# EAGLE design Frigo-Ctl2 (EAGLE 9.0.1)
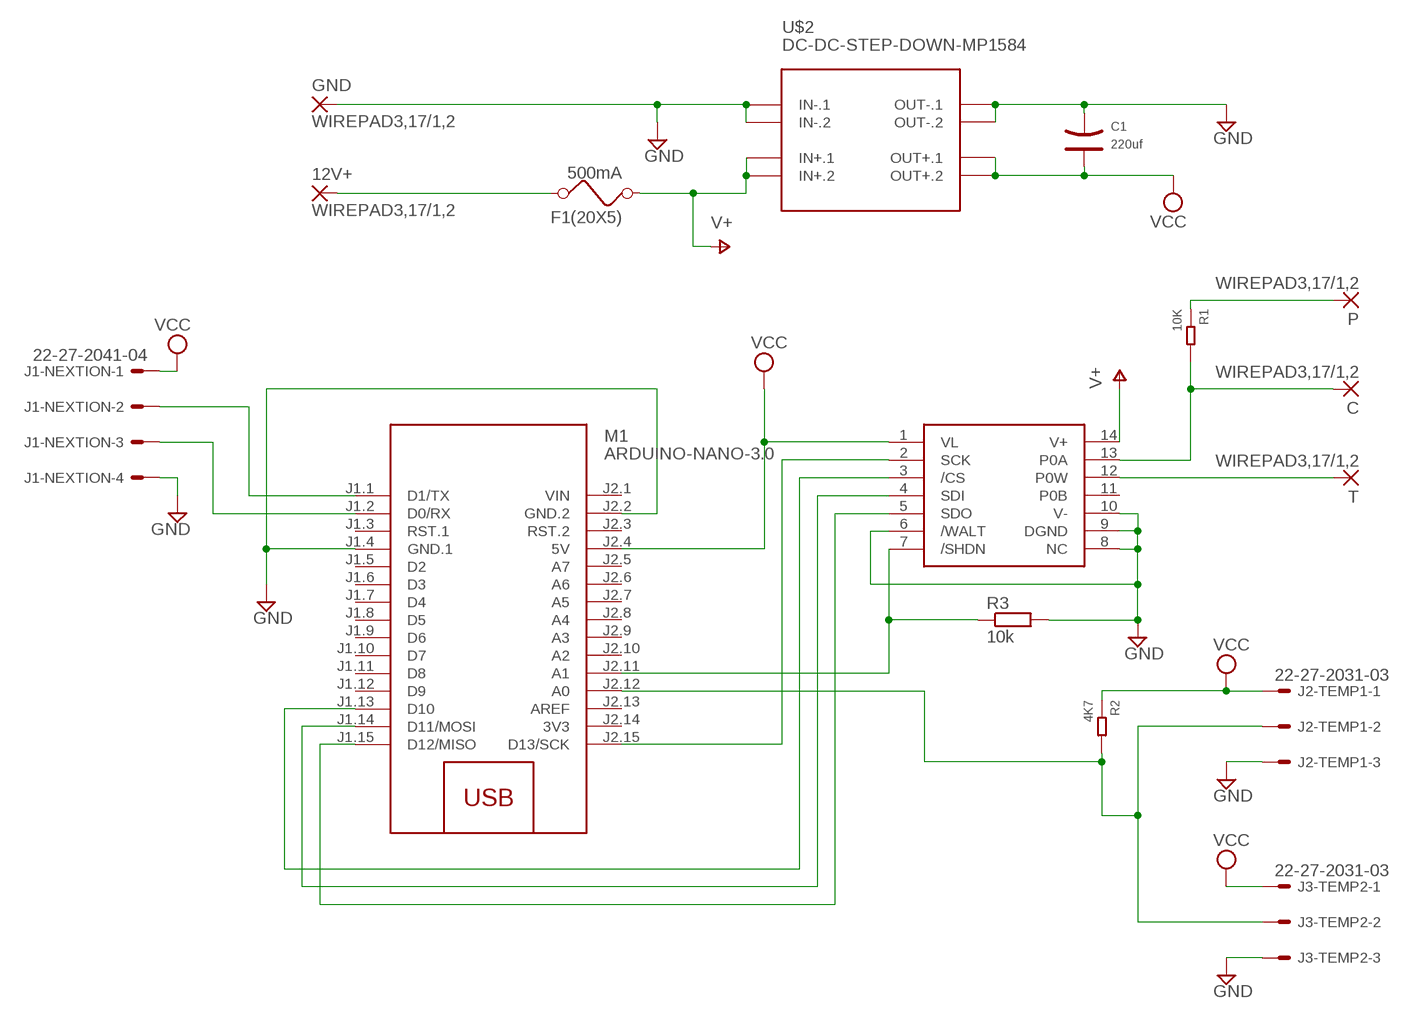
[diagram p0: schematic, sheet 1]

## Parts
12V+  WIREPAD3,17/1,2  [3,17/1,2]
C  WIREPAD3,17/1,2  [3,17/1,2]
C1  220uf  DIP-ALUMINUM-100UF-16V(D5-H7MM)  [PC-D5.3MM]
F1(20X5)  500mA  FUSE  [FUSE]
GND  WIREPAD3,17/1,2  [3,17/1,2]
J1-NEXTION  22-27-2041-04  [6410-04]
J2-TEMP1  22-27-2031-03  [6410-03]
J3-TEMP2  22-27-2031-03  [6410-03]
M1  ARDUINO-NANO-3.0  [ARDUINO-NANO-3.0]
P  WIREPAD3,17/1,2  [3,17/1,2]
R1  10K  DIP-RES-10K-5%-1/4W(PR-D2.3XL6.5MM)  [PR-D2.3XL6.5MM]
R2  4K7  DIP-RES-10K-5%-1/4W(PR-D2.3XL6.5MM)  [PR-D2.3XL6.5MM]
R3  10k  R-EU_R1206  [R1206]
T  WIREPAD3,17/1,2  [3,17/1,2]
U$1  MCP41HV51  [TSSOP14]
U$2  DC-DC-STEP-DOWN-MP1584  [DC-DC-STEP-DOWN-MP1584]

## Nets
GND: C1.- GND.1(P) J1-NEXTION.4 J2-TEMP1.3 J3-TEMP2.3 M1.J1.4(GND.1) M1.J2.2(GND.2) R3.2 U$1.6(/WALT) U$1.8(NC) U$1.9(DGND) U$1.10(V-) U$2.IN-.1 U$2.IN-.2 U$2.OUT-.1 U$2.OUT-.2
N$1: 12V+.1(P) F1(20X5).2
N$2: M1.J2.11(A1) R3.1 U$1.7(/SHDN)
N$3: J1-NEXTION.2 M1.J1.1(D1/TX)
N$4: J1-NEXTION.3 M1.J1.2(D0/RX)
N$5: C.1(P) R1.2 U$1.13(P0A)
N$6: P.1(P) R1.1
N$7: M1.J1.13(D10) U$1.3(/CS)
N$8: T.1(P) U$1.12(P0W)
N$9: M1.J2.15(D13/SCK) U$1.2(SCK)
N$10: M1.J1.15(D12/MISO) U$1.5(SDO)
N$11: M1.J1.14(D11/MOSI) U$1.4(SDI)
N$13: J2-TEMP1.2 J3-TEMP2.2 M1.J2.12(A0) R2.2
V+: F1(20X5).1 U$1.14(V+) U$2.IN+.1 U$2.IN+.2
VCC: C1.+ J1-NEXTION.1 J2-TEMP1.1 J3-TEMP2.1 M1.J2.4(5V) R2.1 U$1.1(VL) U$2.OUT+.1 U$2.OUT+.2
Unconnected: M1.J1.3(RST.1) M1.J1.5(D2) M1.J1.6(D3) M1.J1.7(D4) M1.J1.8(D5) M1.J1.9(D6) M1.J1.10(D7) M1.J1.11(D8) M1.J1.12(D9) M1.J2.3(RST.2) M1.J2.5(A7) M1.J2.6(A6) M1.J2.7(A5) M1.J2.8(A4) M1.J2.9(A3) M1.J2.10(A2) M1.J2.13(AREF) U$1.11(P0B)

## Power pins joined to a net without a drawn wire
3V3: M1.J2.14(3V3)
VIN: M1.J2.1(VIN)

## Library data of the parts
12V+ C GND P T = wirepad:WIREPAD: Wire PAD connect wire on PCB
C1 = Seeed-Capacitor:DIP-ALUMINUM-100UF-16V(D5-H7MM): 302030031; MPN: KS 100uF/16V; VALUE: 100uf
F1(20X5) = special:FUSE: FUSE 5 x 20 mm
J1-NEXTION = con-molex:22-?-04: CONNECTOR wire to board 2.54 mm (.1 inch) pitch header; MF: MOLEX; OC_FARNELL: unknown; OC_NEWARK: unknown
J2-TEMP1 J3-TEMP2 = con-molex:22-?-03: CONNECTOR wire to board 2.54 mm (.1 inch) pitch header; MF: MOLEX; OC_FARNELL: unknown; OC_NEWARK: unknown
M1 = diy-modules:ARDUINO-NANO-3.0: Arduino Nano 3.0 and compatible devices More details available here: https://www.arduino.cc/en/Main/ArduinoBoardNano Click here to find device on ebay.com <http://www.ebay.com/sch/arduino+nano>
R1 = Seeed-Resistor:DIP-RES-10K-5%-1/4W(PR-D2.3XL6.5MM): 301020001; MPN: FHCFR-1/4W-103J
R2 = Seeed-Resistor:DIP-RES-10K-5%-1/4W(PR-D2.3XL6.5MM): 301020001; MPN: FHCFR-1/4W-103J; VALUE: 10K
R3 = resistor:R-EU_: RESISTOR, European symbol
U$1 = MCP41HV51:MCP41HV51: 8-Bit Single, +36V (±18V) Digital POT with SPI Serial Interface and Volatile Memory
U$2 = diy-modules:DC-DC-STEP-DOWN-MP1584: DC/DC Step-Down Regulator based on MP1584 chip MP1584 datasheet available here: http://www.haoyuelectronics.com/Attachment/MP1584/MP1584.pdf Click here to find device on ebay.com <http://www.ebay.com/sch/mp1584+module>

## Board
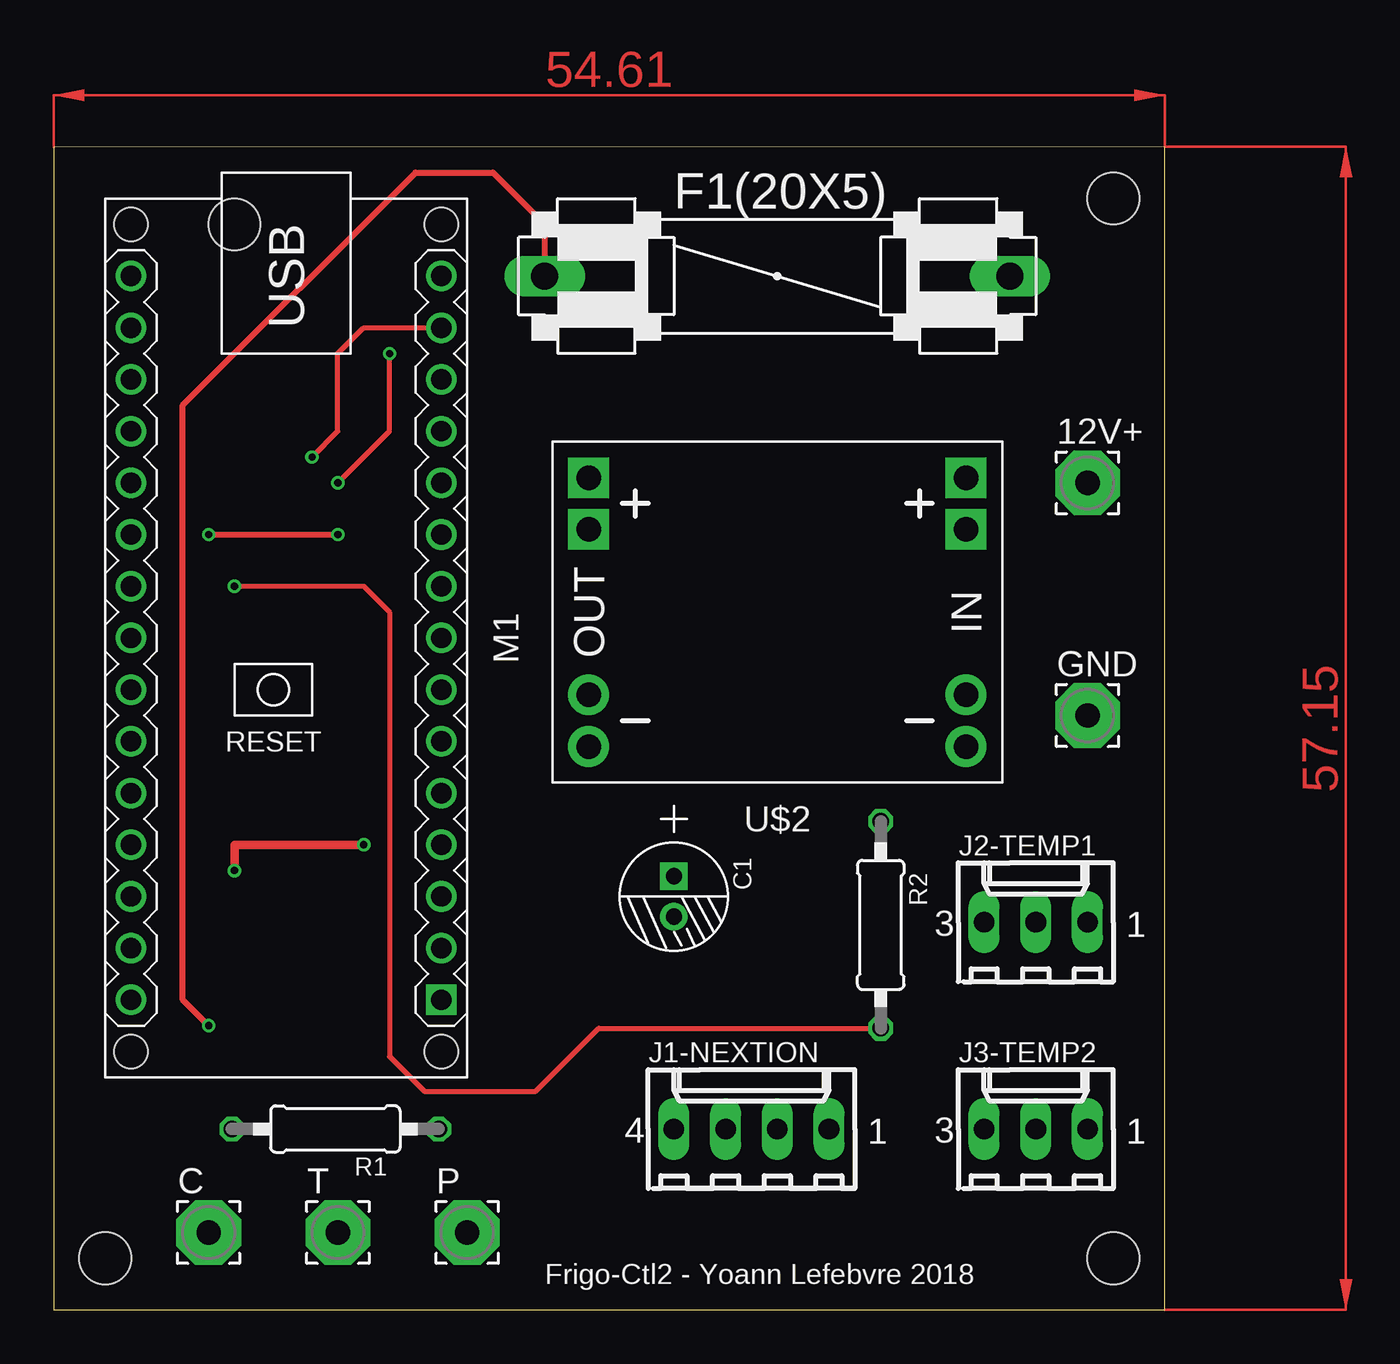
[diagram p1: board, top side]
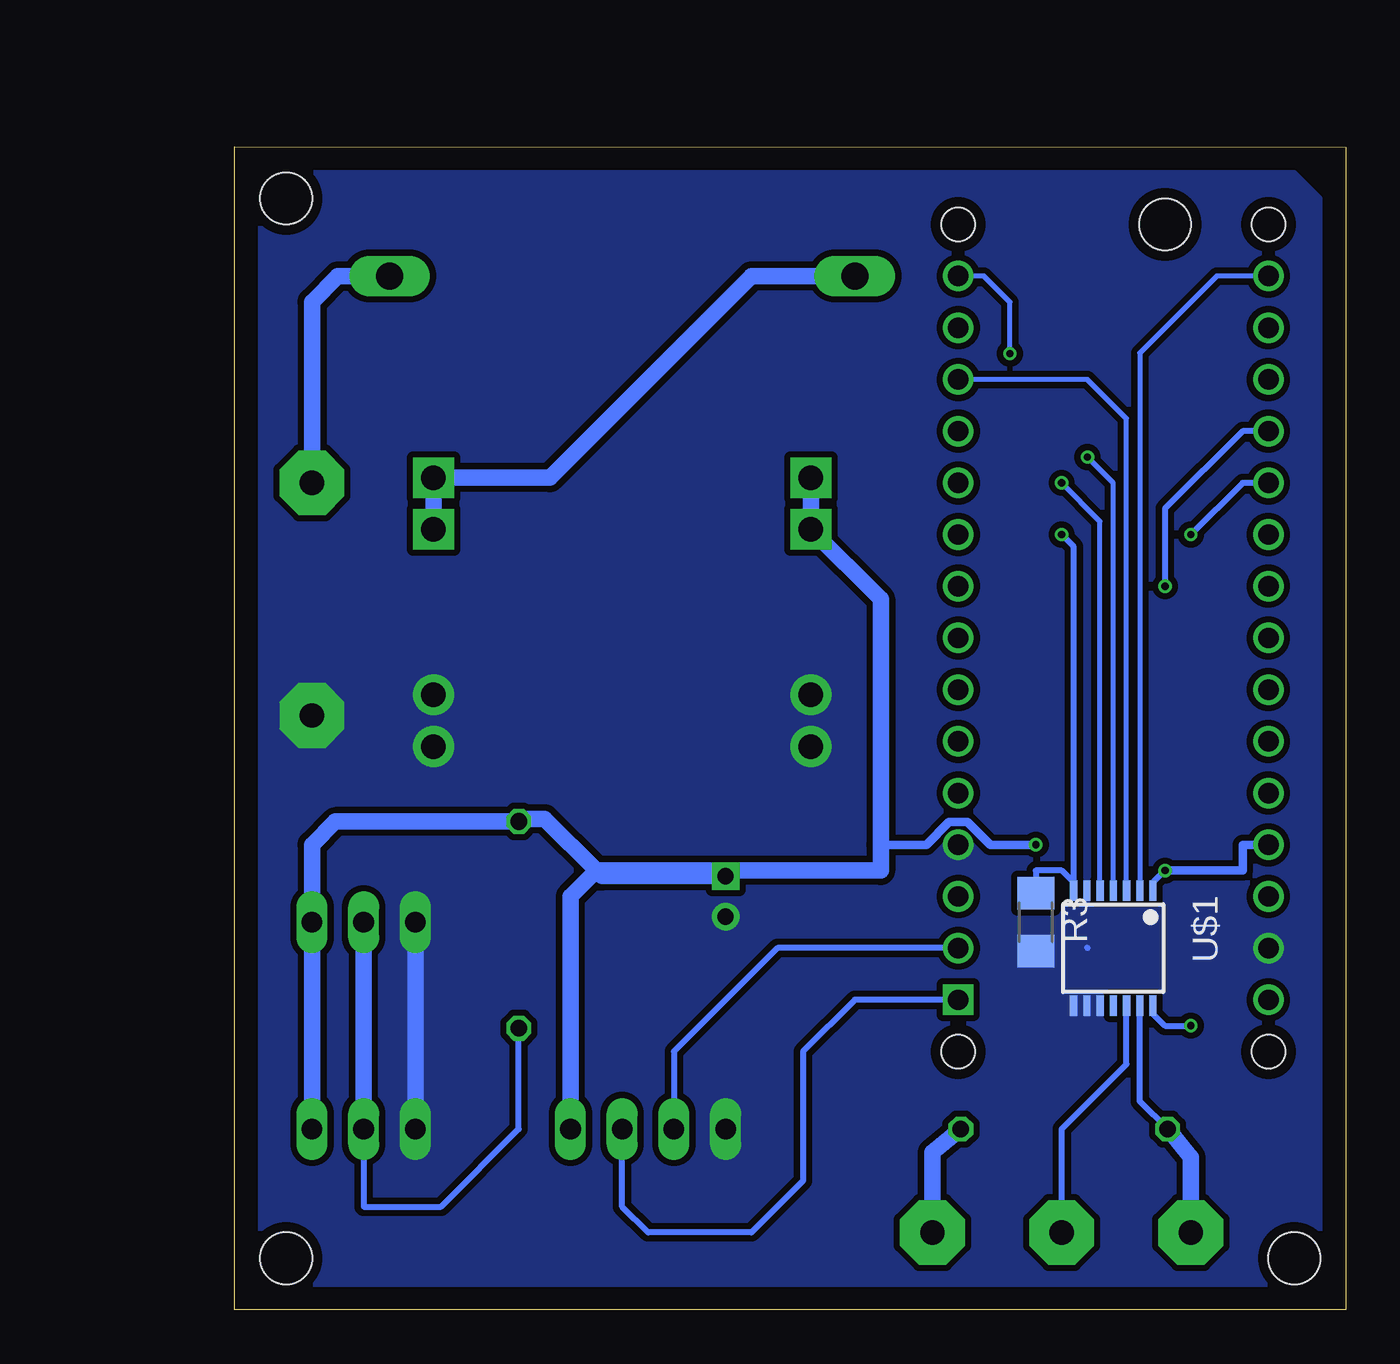
[diagram p2: board, bottom side, seen from below]

Size 54.61 x 57.15 mm. Coordinates in mm from the lower left corner, seen from the top.
Outline: 0,0 54.61,0 54.61,57.15 0,57.14 0,0
Copper layers (1*16): Top 0.035mm / dielectric 1.6mm / Bottom 0.035mm
Design rules "Elecrow_2-layer_PCB_eagle_rule": minimum track width 6mil, minimum drill 12mil, track to track 6mil, track to pad 6mil, pad to pad 6mil, via to via 8mil, smd to smd 0mil, copper to edge 20mil, drill to drill 10mil, minimum pad ring 6mil, minimum via ring 6mil, stop-mask expansion 0mil, vias tented up to drill 100mil, thermal gap 10mil
Holes 2.54 mm at 52.07,54.61 2.54,2.54 8.89,53.34 52.07,2.54

### Footprints (pad centres in the part's own frame; a part is rotated, then mirrored left to right if it is on the bottom)
3,17/1,2 = drill 1.194 pad 3.175 octagon: 1 0,0
PC-D5.3MM = drill 0.8 pad 1.35 square: + -1,0 | drill 0.8 pad 1.35: - 1,0
FUSE = drill 1.321 long: 1 -11.43,0; 2 11.43,0
6410-04 = drill 1.016 long: 1 3.81,0; 2 1.27,0; 3 -1.27,0; 4 -3.81,0
6410-03 = drill 1.016 long: 1 2.54,0; 2 0,0; 3 -2.54,0
ARDUINO-NANO-3.0 = drill 1 square: J1.1 17.78,7.62 | drill 1: J1.2 15.24,7.62; J1.3 12.7,7.62; J1.4 10.16,7.62; J1.5 7.62,7.62; J1.6 5.08,7.62; J1.7 2.54,7.62; J1.8 0,7.62; J1.9 -2.54,7.62; J1.10 -5.08,7.62; J1.11 -7.62,7.62; J1.12 -10.16,7.62; J1.13 -12.7,7.62; J1.14 -15.24,7.62; J1.15 -17.78,7.62; J2.1 17.78,-7.62; J2.2 15.24,-7.62; J2.3 12.7,-7.62; J2.4 10.16,-7.62; J2.5 7.62,-7.62; J2.6 5.08,-7.62; J2.7 2.54,-7.62; J2.8 0,-7.62; J2.9 -2.54,-7.62; J2.10 -5.08,-7.62; J2.11 -7.62,-7.62; J2.12 -10.16,-7.62; J2.13 -12.7,-7.62; J2.14 -15.24,-7.62; J2.15 -17.78,-7.62 | hole 1.651: -20.32,7.62; -20.32,-7.62; 20.32,-7.62; 20.32,7.62
PR-D2.3XL6.5MM = drill 0.813 octagon: 1 -4.953,0; 2 5.207,0
R1206 = smd 1.6 x 1.803: 1 -1.422,0; 2 1.422,0
TSSOP14 = smd 0.35 x 1: 1 -1.95,-2.825; 2 -1.3,-2.825; 3 -0.65,-2.825; 4 0,-2.825; 5 0.65,-2.825; 6 1.3,-2.825; 7 1.95,-2.825; 8 1.95,2.825; 9 1.3,2.825; 10 0.65,2.825; 11 0,2.825; 12 -0.65,2.825; 13 -1.3,2.825; 14 -1.95,2.825
DC-DC-STEP-DOWN-MP1584 = drill 1.2 pad 2 square: IN+.1 -9.271,-4.064; IN+.2 -9.271,-6.604; OUT+.1 9.271,-4.064; OUT+.2 9.271,-6.604 | drill 1.2 pad 2: IN-.1 -9.271,6.604; IN-.2 -9.271,4.064; OUT-.1 9.271,6.604; OUT-.2 9.271,4.064

### Placement (x,y rotation side)
12V+  50.8,40.64 0 top
C  7.62,3.81 0 top
C1  30.48,20.32 270 top
F1(20X5)  35.56,50.8 0 top
GND  50.8,29.21 0 top
J1-NEXTION  34.29,8.89 0 top
J2-TEMP1  48.26,19.05 0 top
J3-TEMP2  48.26,8.89 0 top
M1  11.43,33.02 270 top
P  20.32,3.81 0 top
R1  13.97,8.89 180 top
R2  40.64,19.05 270 top
R3  15.24,19.05 270 bottom
T  13.97,3.81 0 top
U$1  11.43,17.78 180 bottom
U$2  35.56,34.29 180 top

### Tracks (layer width: path | path; a pad name or v marks a point on that pad's centre or on a via)
GND
  Bottom 0.305: 12.73,17.81 12.7,17.78
  Bottom 0.813: J3-TEMP2.3 J2-TEMP1.3
  pour Bottom (isolate 0.305, no thermals): 2.54,55.88 52.07,55.88 53.34,54.61 53.34,2.54 52.07,1.27 2.54,1.27 1.27,2.54 1.27,54.61
N$1
  Bottom 0.813: F1(20X5).2 49.53,50.8 50.8,49.53 12V+.1
N$2  (via drill 0.35)
  Top 0.305: v7.62,38.1 v13.97,38.1
  Bottom 0.305: R3.1 15.24,21.59 13.97,21.59 13.38,21 U$1.7 13.38,37.51 v13.97,38.1 | M1.J2.11 5.08,40.64 v7.62,38.1
N$3
  Bottom 0.305: J1-NEXTION.2 35.29,8.89 35.56,8.62 35.56,5.08 34.29,3.81 29.21,3.81 26.67,6.35 26.67,12.7 24.13,15.24 M1.J1.1
N$4
  Bottom 0.305: M1.J1.2 27.94,17.78 33.02,12.7 J1-NEXTION.3
N$5
  Bottom 0.305: R1.2 10.13,10.26 U$1.13
  Bottom 0.813: R1.2 7.62,7.49 C.1
N$6
  Bottom 0.813: P.1 20.32,7.75 R1.1
N$7
  Bottom 0.254: U$1.3 10.78,43.8 12.7,45.72 M1.J1.13
N$8
  Bottom 0.305: U$1.12 10.78,12.08 13.97,8.89 T.1
N$9
  Bottom 0.254: M1.J2.15 6.35,50.8 10.13,47.02 U$1.2
N$10  (via drill 0.35)
  Top 0.254: v13.97,40.64 16.51,43.18 v16.51,46.99
  Bottom 0.254: U$1.5 12.08,38.75 v13.97,40.64 | v16.51,46.99 16.51,49.53 17.78,50.8 M1.J1.15
N$11  (via drill 0.35)
  Top 0.254: v12.7,41.91 13.97,43.18 13.97,46.99 15.24,48.26 M1.J1.14
  Bottom 0.254: U$1.4 11.43,40.64 v12.7,41.91
N$13  (via drill 0.35)
  Top 0.254: v8.89,35.56 15.24,35.56 16.51,34.29 16.51,12.46 18.23,10.73 23.68,10.73 26.79,13.84 R2.2
  Bottom 0.305: J3-TEMP2.2 48.26,5.08 44.45,5.08 40.64,8.89 R2.2 40.64,13.97 | M1.J2.12 5.08,43.18 8.89,39.37 v8.89,35.56
  Bottom 0.813: J3-TEMP2.2 J2-TEMP1.2
V+  (via drill 0.35)
  Top 0.305: v7.62,13.97 6.35,15.24 6.35,44.45 17.78,55.88 21.59,55.88 24.13,53.34 F1(20X5).1
  Bottom 0.305: U$1.14 9.48,14.56 8.89,13.97 v7.62,13.97
  Bottom 0.813: F1(20X5).1 29.21,50.8 39.12,40.89 U$2.IN+.2 U$2.IN+.1
VCC  (via drill 0.35)
  Top 0.406: v8.89,21.59 8.89,22.86 v15.24,22.86
  Bottom 0.254: U$1.1 9.48,20.91
  Bottom 0.305: U$1.1 9.48,21 v8.89,21.59
  Bottom 0.406: M1.J2.4 5.08,22.86 5.08,21.59 v8.89,21.59 | v15.24,22.86 17.48,22.86 18.59,23.97 19.51,23.97 20.62,22.86 22.86,22.86
  Bottom 0.813: U$2.OUT+.2 U$2.OUT+.1 22.86,34.92 22.86,22.86 22.86,21.59 30.75,21.59 | 30.75,21.59 C1.+ 36.56,21.32 36.83,21.59 | 30.75,21.59 36.83,21.59 | 36.83,21.59 39.37,24.13 40.51,24.13 R2.1 49.66,24 50.8,22.86 J2-TEMP1.1 J3-TEMP2.1 | J1-NEXTION.1 38.1,20.32 36.83,21.59
(copper drawn outside any net)
  shapes: Top area x2

### Text on the board
tNames: Frigo-Ctl2 - Yoann Lefebvre 2018